# EAGLE design Peltier_Controller (EAGLE 8.1.0)

## Sheet 1 of 2
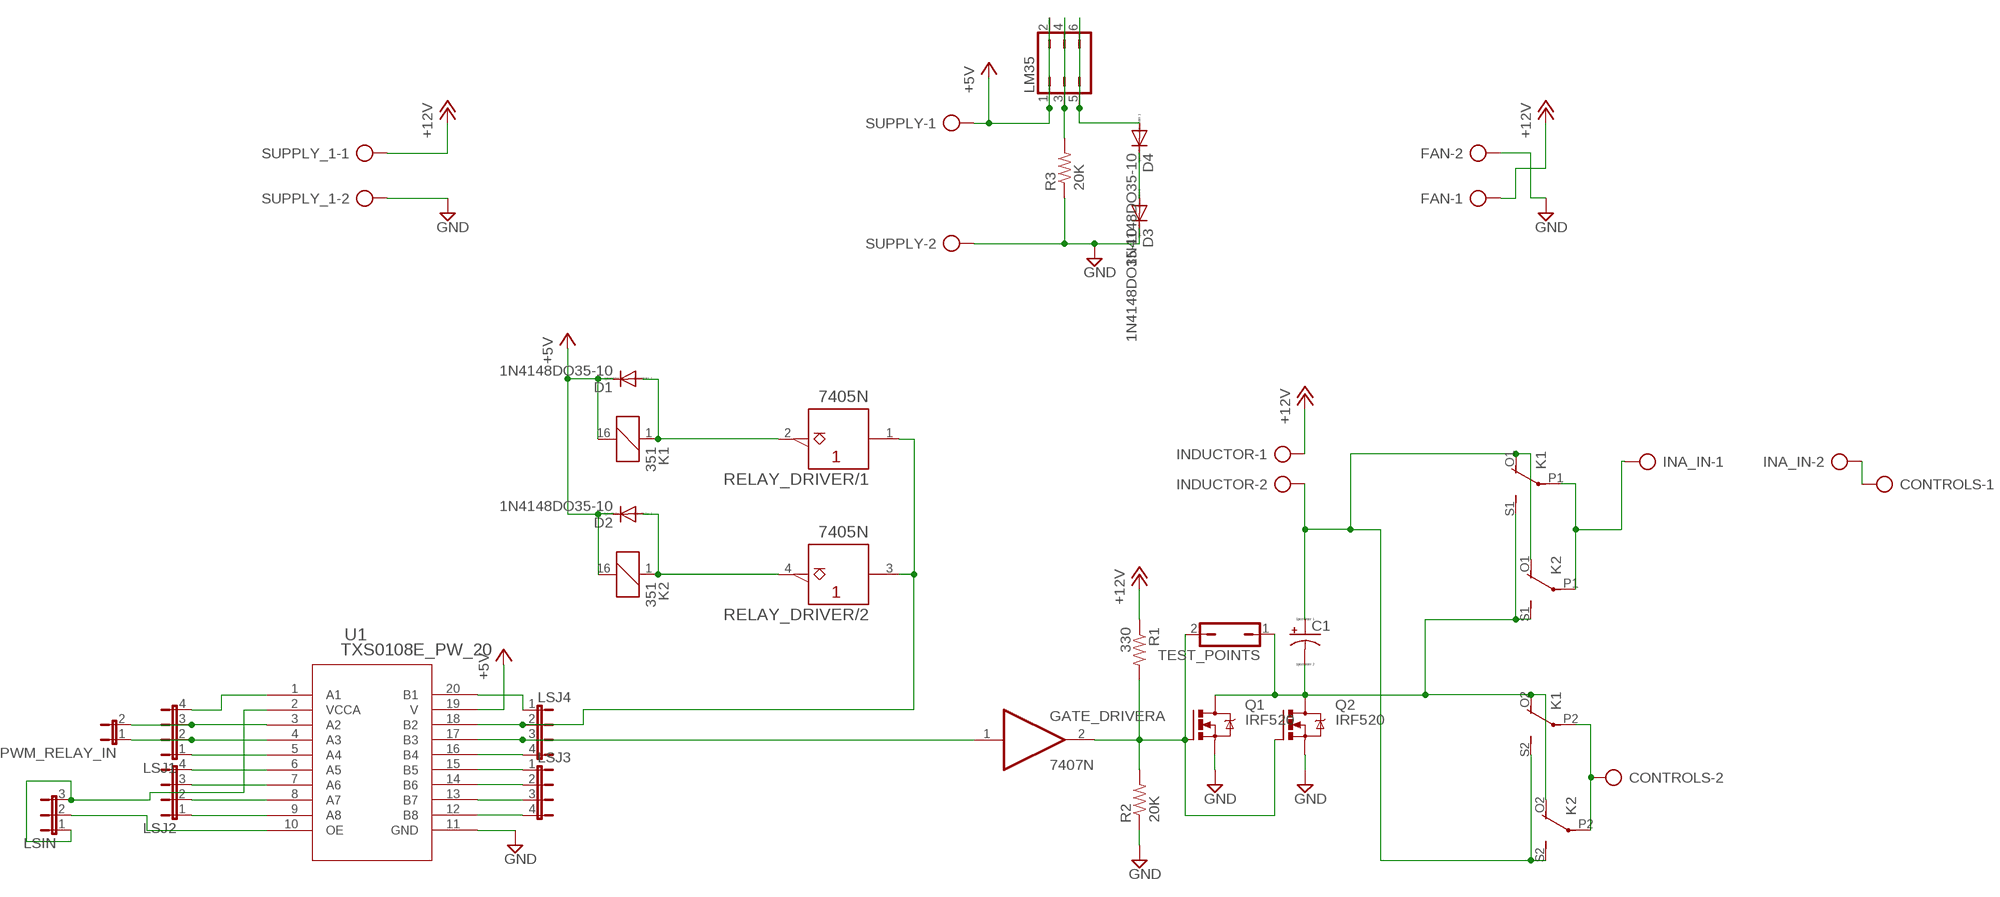
[diagram p0: schematic, sheet 1]

### Parts
C1  CPOL-USTT6D6  [TT5D6]
CONTROLS  AK500/2-H  [AK500/2-H]
D1  1N4148DO35-10  [DO35-10]
D2  1N4148DO35-10  [DO35-10]
D3  1N4148DO35-10  [DO35-10]
D4  1N4148DO35-10  [DO35-10]
FAN  AK500/2-H  [AK500/2-H]
GATE_DRIVER  7407N  [DIL14]
INA_IN  AK500/2-H  [AK500/2-H]
INDUCTOR  AK500/2-H  [AK500/2-H]
K1  351  [351]
K2  351  [351]
LM35  JP3Q  [JP3Q]
LSIN  JP2E  [JP2]
LSJ1  JP4E  [JP4]
LSJ2  JP4E  [JP4]
LSJ3  JP4E  [JP4]
LSJ4  JP4E  [JP4]
PWM_RELAY_IN  JP1E  [JP1]
Q1  IRF520  [TO220BV]
Q2  IRF520  [TO220BV]
R1  330  R-US_0207/12  [0207/12]
R2  20K  R-US_0207/12  [0207/12]
R3  20K  R-US_0207/12  [0207/12]
RELAY_DRIVER  7405N  [DIL14]
SUPPLY  AK500/2-H  [AK500/2-H]
SUPPLY_1  AK500/2-H  [AK500/2-H]
TEST_POINTS  JP1Q  [JP1]
U1  TXS0108E_PW_20  [PW20]

### Nets
+5V: D1.C D2.C K1.16 K2.16 LM35.1 LM35.2 SUPPLY.1 U1.19(V) ; also sheet 2
+12V: FAN.1 INDUCTOR.1 R1.1 SUPPLY_1.1
GND: D3.C FAN.2 Q1.S Q2.S R2.1 R3.1 SUPPLY.2 SUPPLY_1.2 U1.11(GND) ; also sheet 2
IN+: CONTROLS.1 INA_IN.2 ; also sheet 2
IN-: INA_IN.1 K1.P1(2:P) K2.P1(2:P) ; also sheet 2
N$1: LSJ1.3 PWM_RELAY_IN.2 U1.3(A2)
N$2: D2.A K2.1 RELAY_DRIVER.4(/2:Y)
N$3: LM35.3 LM35.4 R3.2
N$4: D1.A K1.1 RELAY_DRIVER.2(/1:Y)
N$5: GATE_DRIVER.2(A:O) Q1.G Q2.G R1.2 R2.2 TEST_POINTS.2
N$6: D4.A LM35.5 LM35.6
N$7: D3.A D4.C
N$8: LSJ1.4 U1.1(A1)
N$9: LSJ4.1 U1.20(B1)
N$12: CONTROLS.2 K1.P2(3:P) K2.P2(3:P)
N$13: C1.- K1.O2(3:O) K1.S1(2:S) K2.O2(3:O) K2.S1(2:S) Q1.D Q2.D TEST_POINTS.1
N$15: LSJ1.2 PWM_RELAY_IN.1 U1.4(A3)
N$16: LSJ1.1 U1.5(A4)
N$17: LSJ2.4 U1.6(A5)
N$18: LSJ2.3 U1.7(A6)
N$19: LSJ2.2 U1.8(A7)
N$20: LSJ2.1 U1.9(A8)
N$21: LSIN.2 U1.10(OE)
N$22: LSIN.1 LSIN.3 U1.2(VCCA)
N$23: LSJ4.2 RELAY_DRIVER.1(/1:A) RELAY_DRIVER.3(/2:A) U1.18(B2)
N$25: GATE_DRIVER.1(A:I) LSJ4.3 U1.17(B3)
N$26: LSJ4.4 U1.16(B4)
N$27: LSJ3.1 U1.15(B5)
N$28: LSJ3.2 U1.14(B6)
N$29: LSJ3.3 U1.13(B7)
N$30: LSJ3.4 U1.12(B8)
VBUS: C1.+ INDUCTOR.2 K1.O1(2:O) K1.S2(3:S) K2.O1(2:O) K2.S2(3:S) ; also sheet 2
Unconnected: GATE_DRIVER.3(B:I) GATE_DRIVER.4(B:O) GATE_DRIVER.5(C:I) GATE_DRIVER.6(C:O) GATE_DRIVER.8(D:O) GATE_DRIVER.9(D:I) GATE_DRIVER.10(E:O) GATE_DRIVER.11(E:I) GATE_DRIVER.12(F:O) GATE_DRIVER.13(F:I) RELAY_DRIVER.5(/3:A) RELAY_DRIVER.6(/3:Y) RELAY_DRIVER.8(/4:Y) RELAY_DRIVER.9(/4:A) RELAY_DRIVER.10(/5:Y) RELAY_DRIVER.11(/5:A) RELAY_DRIVER.12(/6:Y) RELAY_DRIVER.13(/6:A)

## Sheet 2 of 2
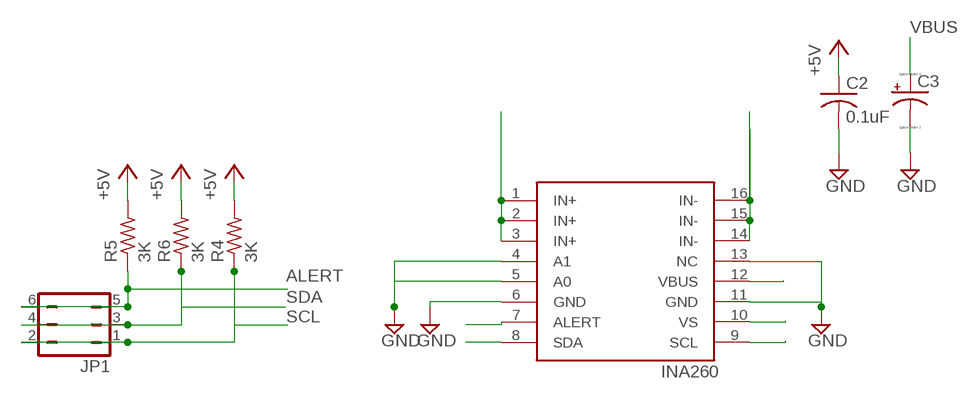
[diagram p1: schematic, sheet 2]

### Parts
C2  0.1uF  C-US050-025X075  [C050-025X075]
C3  CPOL-USE5-10.5  [E5-10,5]
JP1  JP3Q  [JP3Q]
R4  3K  R-US_0207/10  [0207/10]
R5  3K  R-US_0207/10  [0207/10]
R6  3K  R-US_0207/10  [0207/10]
U$1  INA260  [TSSOP16]

### Nets
+5V: C2.1 R4.2 R5.2 R6.2 U$1.10(VS) ; also sheet 1
ALERT: JP1.5 JP1.6 R5.1 U$1.7(ALERT)
GND: C2.2 C3.- U$1.4(A1) U$1.5(A0) U$1.6(GND) U$1.11(GND) U$1.13(NC) ; also sheet 1
IN+: U$1.1(IN+) U$1.2(IN+) U$1.3(IN+) ; also sheet 1
IN-: U$1.14(IN-) U$1.15(IN-) U$1.16(IN-) ; also sheet 1
SCL: JP1.1 JP1.2 R4.1 U$1.9(SCL)
SDA: JP1.3 JP1.4 R6.1 U$1.8(SDA)
VBUS: C3.+ U$1.12(VBUS) ; also sheet 1

## Power pins joined to a net without a drawn wire
+5V: GATE_DRIVER.14(P:VCC) RELAY_DRIVER.14(+5V:+UB)
GND: GATE_DRIVER.7(P:GND) RELAY_DRIVER.7(GND:-UB)

## Library data of the parts
C1 C3 = resistor:CPOL-US: POLARIZED CAPACITOR, American symbol
C2 = resistor:C-US: CAPACITOR, American symbol
CONTROLS FAN INA_IN INDUCTOR SUPPLY SUPPLY_1 = con-ptr500:AK500/2-H: CONNECTOR Aug. 2004 / PTR Meßtechnik: Die Bezeichnung der Serie AK505 wurde geändert. Es handelt sich hierbei um AK500 in horizontaler Ausführung.; OC_FARNELL: unknown; OC_NEWARK: unknown
D1-D4 = diode:1N4148: DIODE high speed (Philips)
GATE_DRIVER = 74xx-eu:74*07: Hex BUFFER, open collector high-voltage output
JP1 LM35 = jumper:JP3Q: JUMPER
K1 K2 = relay:351: RELAY 2 x switch, Omron; OC_FARNELL: unknown; OC_NEWARK: unknown
LSIN = jumper:JP2E: JUMPER
LSJ1-LSJ4 = jumper:JP4E: JUMPER
PWM_RELAY_IN = jumper:JP1E: JUMPER
Q1 Q2 = transistor-power:IRF520: HEXFET Power MOSFET
R1-R3 = resistor:R-US_: RESISTOR, American symbol
R4-R6 = rcl:R-US_: RESISTOR, American symbol
RELAY_DRIVER = 74ttl-din:74*05: Hex INVERTER, open collector
TEST_POINTS = jumper:JP1Q: JUMPER
U1 = texas:TXS0108E_PW_20; DATASHEETURL: httpwww.ti.comlitgpnTXS0108E; FAMILY_NAME: AUTO DIRECTION SENSING DUAL SUPPLY TRANSLATOR; GENERIC_PART_NUMBER: TXS0108E; INDUSTRY_STD_PKG_TYPE: TSSOP; MANUFACTURER: Texas Instruments; MANUFACTURER_PART_NUMBER: txs0108e_pw_20; PACKAGE_DESIGNATOR: PW; PIN_COUNT: 20; VENDOR: Texas Instruments
U$1 = INA260:INA260: High/Low-Side Digital Current/Power Monitor with Integrated 2mΩ Shunt Resistor http://www.ti.com/product/INA260/description; MANUFACTURER: Texas Instruments

## Net classes
0 default: width 0.406 mm, drill 0.762 mm, clearance 0.406 mm

## Board
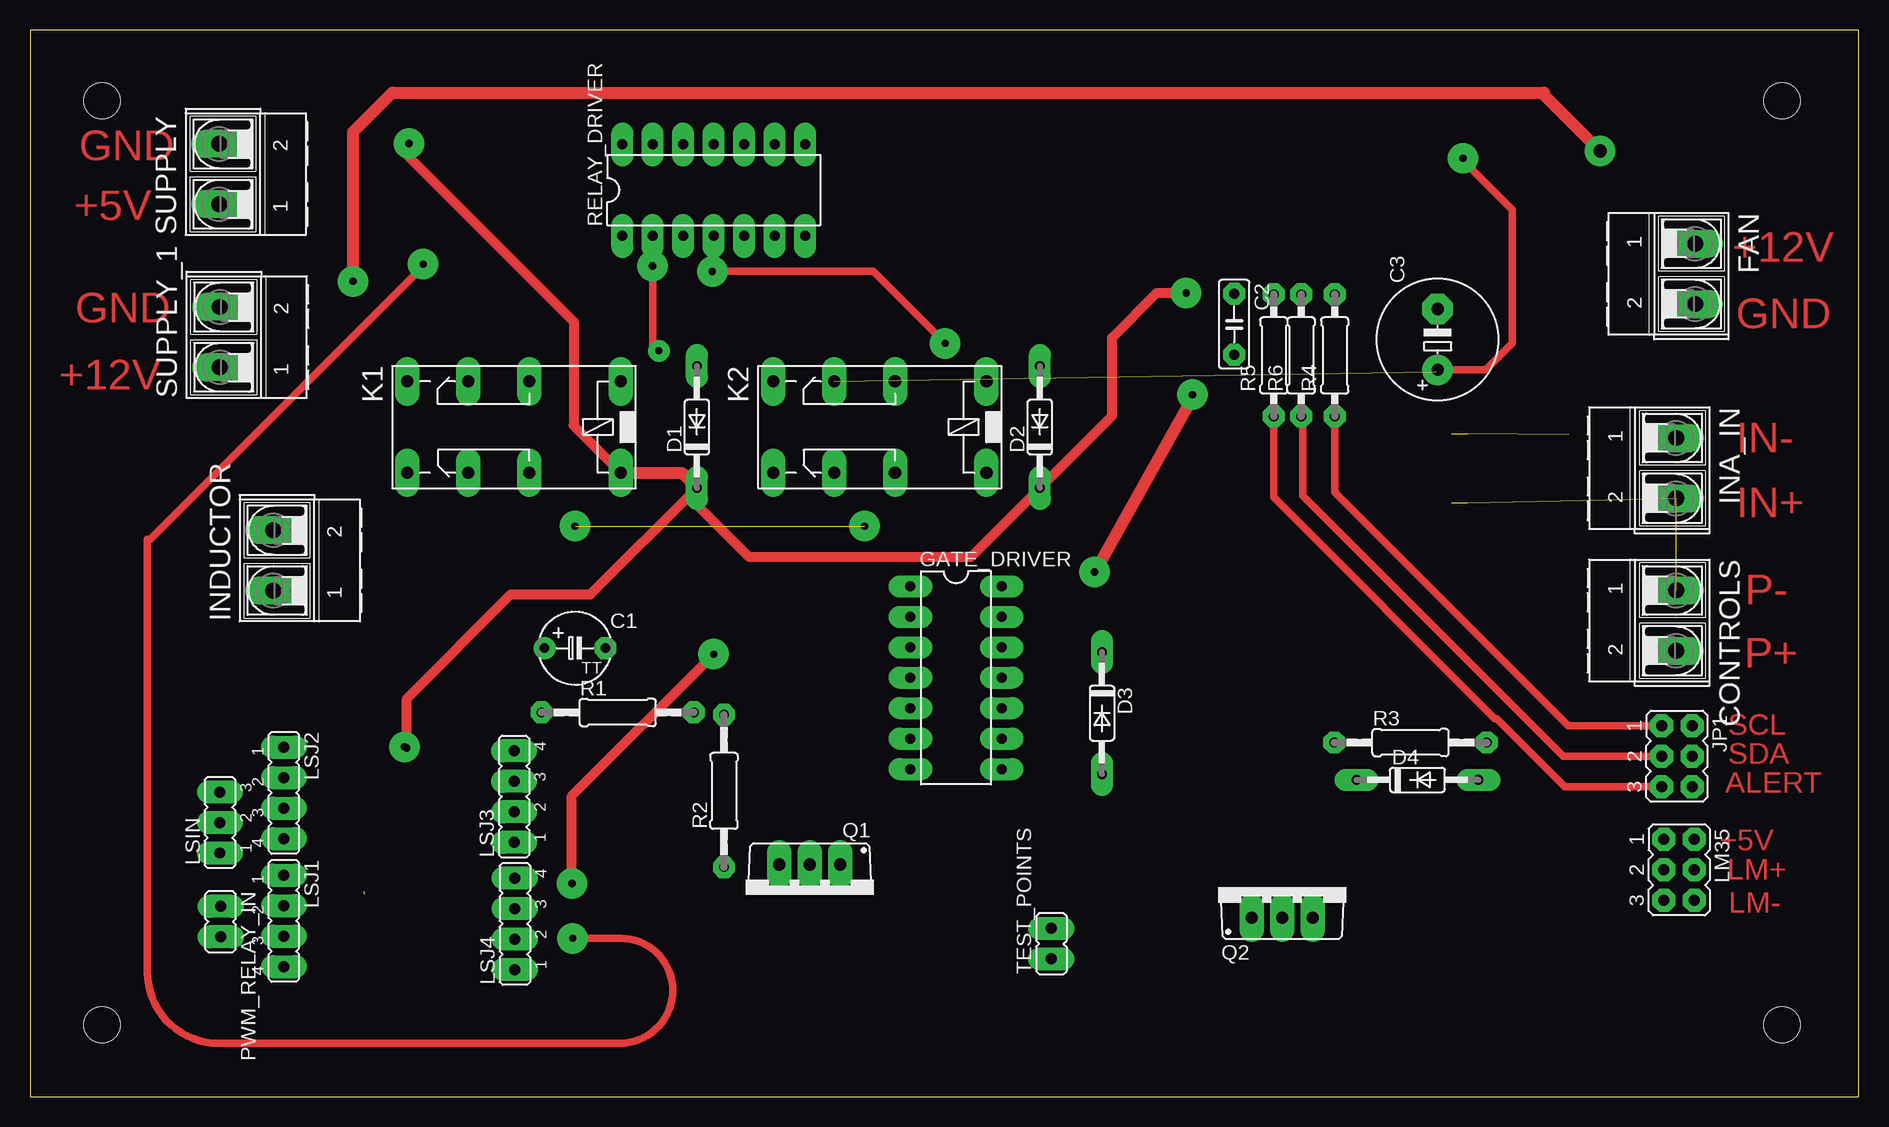
[diagram p2: board, top side]
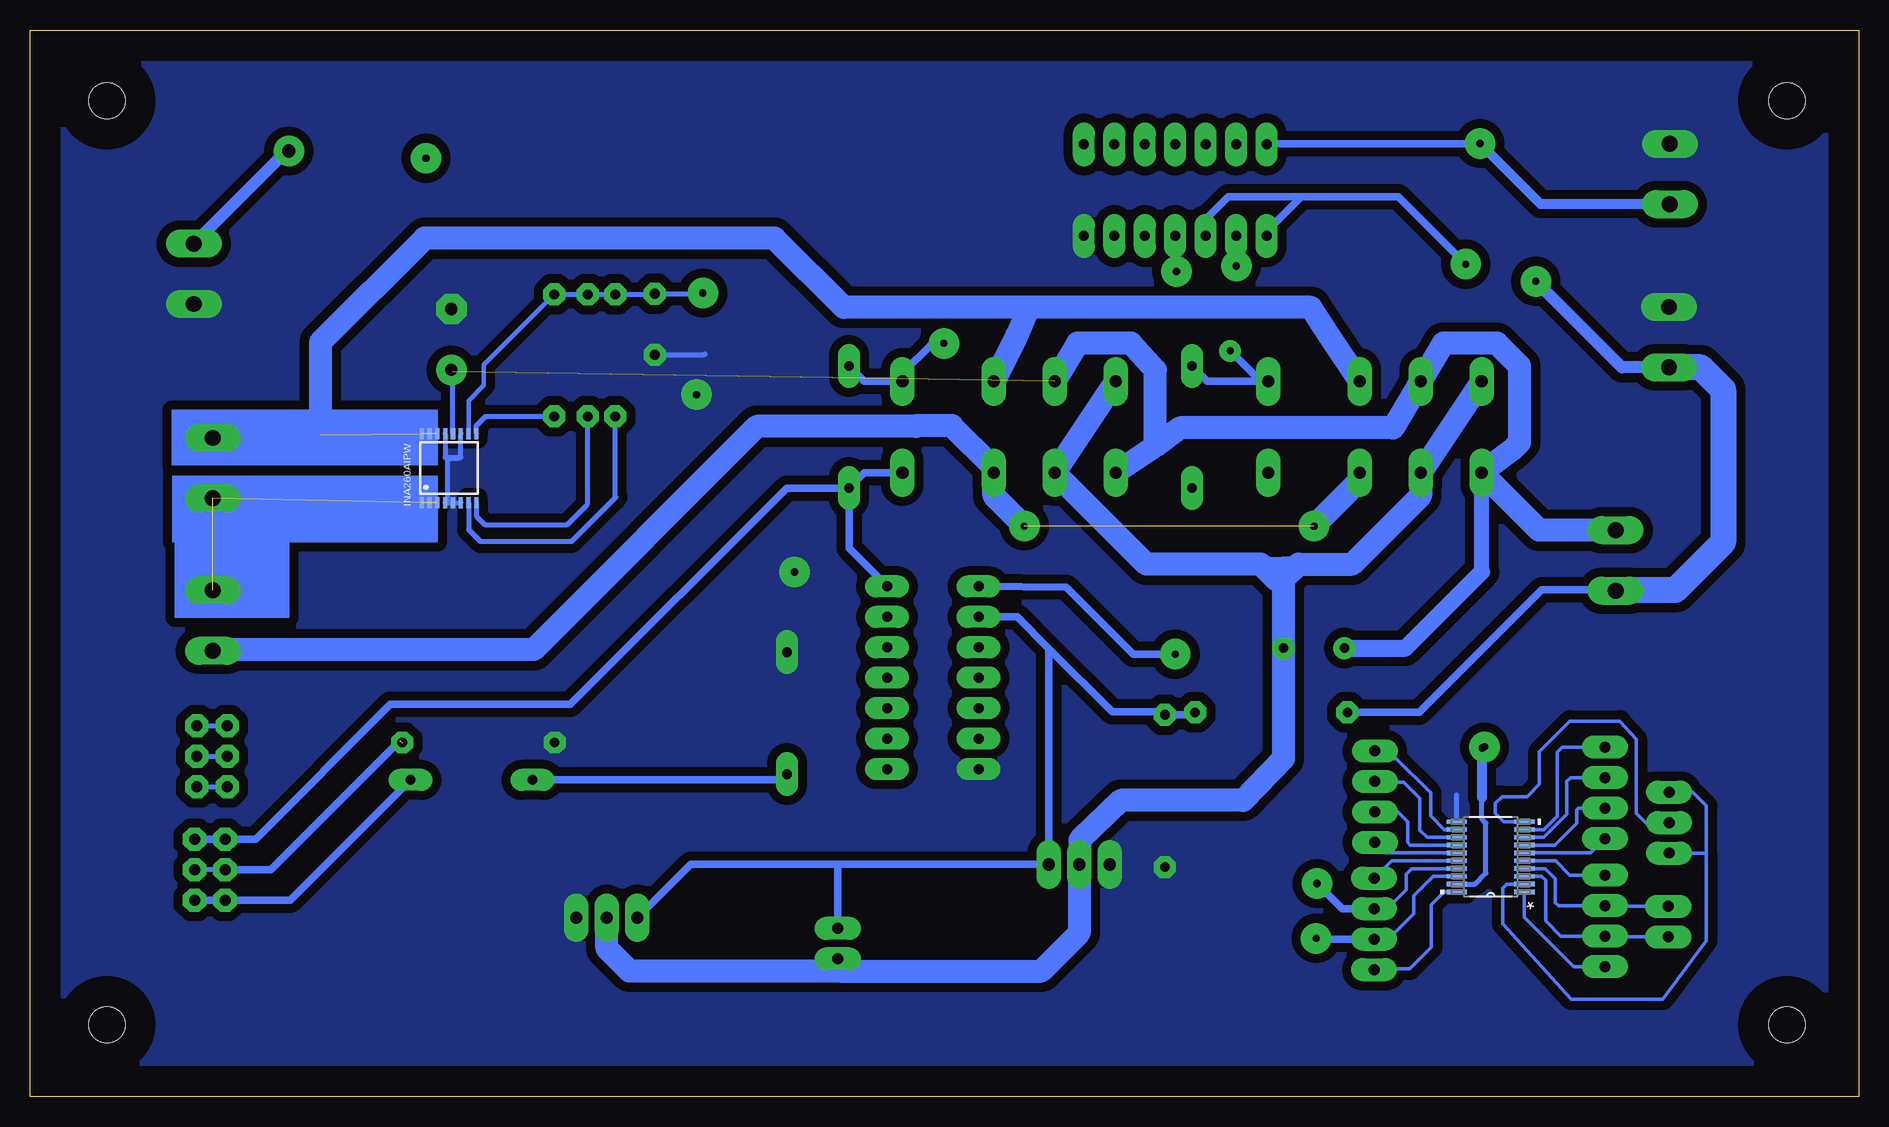
[diagram p3: board, bottom side, seen from below]

Size 152.41 x 88.89 mm. Coordinates in mm from the lower left corner, seen from the top.
Outline: 0,0 152.41,0 152.41,88.89 0,88.89 0,0
Copper layers (1*16): Top 0.035mm / dielectric 1.5mm / Bottom 0.035mm
Design rules "default *": minimum track width 10mil, minimum drill 24mil, track to track 30mil, track to pad 30mil, pad to pad 30mil, via to via 40mil, smd to smd 8mil, copper to edge 100mil, drill to drill 20mil, minimum pad ring 20mil, minimum via ring 8mil, stop-mask expansion 4mil, vias tented up to drill 0mil, thermal gap 0mil
Holes 3 mm at 6,6 6,83 146,6 146,83

### Footprints (pad centres in the part's own frame; a part is rotated, then mirrored left to right if it is on the bottom)
TT5D6 = drill 0.813: + -2.54,0 | drill 0.813 octagon: - 2.54,0
C050-025X075 = drill 0.813 octagon: 1 -2.54,0; 2 2.54,0
E5-10,5 = drill 1.016 pad 2.54: + -2.54,0 | drill 1.016 pad 2.54 octagon: - 2.54,0
AK500/2-H = drill 1.321 long: 1 -2.515,0; 2 2.515,0
DO35-10 = drill 0.813 long: A 5.08,0; C -5.08,0
DIL14 = drill 0.813 long: 1 -7.62,-3.81; 2 -5.08,-3.81; 3 -2.54,-3.81; 4 0,-3.81; 5 2.54,-3.81; 6 5.08,-3.81; 7 7.62,-3.81; 8 7.62,3.81; 9 5.08,3.81; 10 2.54,3.81; 11 0,3.81; 12 -2.54,3.81; 13 -5.08,3.81; 14 -7.62,3.81
JP3Q = drill 0.914 octagon: 1 -2.54,-1.27; 2 -2.54,1.27; 3 0,-1.27; 4 0,1.27; 5 2.54,-1.27; 6 2.54,1.27
351 = drill 1.016 long: 1 -3.81,-3.81; 16 -3.81,3.81; O1 8.89,-3.81; O2 8.89,3.81; P1 3.81,-3.81; P2 3.81,3.81; S1 13.97,-3.81; S2 13.97,3.81
JP2 = drill 0.914 long: 1 -2.54,0; 2 0,0; 3 2.54,0
JP4 = drill 0.914 long: 1 -3.81,0; 2 -1.27,0; 3 1.27,0; 4 3.81,0
JP1 = drill 0.914 long: 1 0,-1.27; 2 0,1.27
TO220BV = drill 1.016 long: D 0,-2.54; G -2.54,-2.54; S 2.54,-2.54
0207/12 = drill 0.813 octagon: 1 -6.35,0; 2 6.35,0
0207/10 = drill 0.813 octagon: 1 -5.08,0; 2 5.08,0
PW20 = smd 1.676 x 0.356: 1 -2.819,2.925; 2 -2.819,2.275; 3 -2.819,1.625; 4 -2.819,0.975; 5 -2.819,0.325; 6 -2.819,-0.325; 7 -2.819,-0.975; 8 -2.819,-1.625; 9 -2.819,-2.275; 10 -2.819,-2.925; 11 2.819,-2.925; 12 2.819,-2.275; 13 2.819,-1.625; 14 2.819,-0.975; 15 2.819,-0.325; 16 2.819,0.325; 17 2.819,0.975; 18 2.819,1.625; 19 2.819,2.275; 20 2.819,2.925
TSSOP16 = smd 0.9 x 0.35: 1 -2.875,2.275; 2 -2.875,1.625; 3 -2.875,0.975; 4 -2.875,0.325; 5 -2.875,-0.325; 6 -2.875,-0.975; 7 -2.875,-1.625; 8 -2.875,-2.275; 9 2.875,-2.275; 10 2.875,-1.625; 11 2.875,-0.975; 12 2.875,-0.325; 13 2.875,0.325; 14 2.875,0.975; 15 2.875,1.625; 16 2.875,2.275

### Placement (x,y rotation side)
C1  45.42,37.38 0 top
C2  100.35,64.37 270 top
C3  117.3,63.1 90 top
CONTROLS  137.18,39.67 270 top
D1  55.58,55.8 90 top
D2  84.15,55.8 90 top
D3  89.33,31.96 270 top
D4  115.62,26.4 0 top
FAN  138.76,68.56 270 top
GATE_DRIVER  77.17,34.91 270 top
INA_IN  137.18,52.37 270 top
INDUCTOR  20.27,44.69 90 top
JP1  137.24,28.37 270 top
K1  45.42,55.8 180 top
K2  75.9,55.8 180 top
LM35  137.43,18.91 270 top
LSIN  15.83,22.84 90 top
LSJ1  21.16,14.65 270 top
LSJ2  21.16,25.32 270 top
LSJ3  40.34,25 90 top
LSJ4  40.4,14.4 90 top
PWM_RELAY_IN  15.89,14.59 180 top
Q1  64.98,16.81 180 top
Q2  104.35,17.45 0 top
R1  48.97,32.02 0 top
R2  57.83,25.48 90 top
R3  115.05,29.51 0 top
R4  108.73,61.77 90 top
R5  103.65,61.77 90 top
R6  105.93,61.77 90 top
RELAY_DRIVER  56.98,75.55 0 top
SUPPLY  15.76,76.88 90 top
SUPPLY_1  15.83,63.29 90 top
TEST_POINTS  85.11,12.75 0 top
U1  30.69,19.99 180 bottom
U$1  117.49,52.37 90 bottom

### Tracks (layer width: path | path; a pad name or v marks a point on that pad's centre or on a via)
+5V  (via drill 0.6, 0.6 pad 2.54)
  Top 0.813: v96.34,66.98 93.9,66.98 90.17,63.25 90.17,56.74 D2.C 78.39,44.96 59.94,44.96 55.58,49.32 D1.C 46.7,41.85 40.07,41.85 31.4,33.18 v31.4,29.05 | v31.57,79.42 31.57,78.31 45.31,64.58 45.31,55.91 K1.16
  Top 1.016: K1.16 54.31,51.99 D1.C
  Bottom 0.356: U$1.10 115.86,58 114.59,59.28 114.59,60.99 R4.2
  Bottom 0.406: R4.2 R6.2 R5.2 100.41,66.85 C2.1 96.28,66.91 | 96.15,66.91 96.28,66.91 | 96.28,66.91 v96.34,66.98 | U1.19 31.98,17.71 31.08,18.61 31.08,22.8 31.42,23.14 31.42,24.89 31.4,24.92
  Bottom 0.61: v31.57,79.42 49.29,79.42 RELAY_DRIVER.14 | K2.16 82.88,51.99 D2.C | D2.C 89.36,50.72 107.39,32.69 122.38,32.69 133.62,21.45 LM35.1 LM35.2 | GATE_DRIVER.14 84.15,45.7 D2.C
  Bottom 0.813: 31.4,24.92 v31.4,29.05 | SUPPLY.1 26.52,74.37 v31.57,79.42
+12V  (via drill 0.6 pad 2.54, 1.1 pad 2.54)
  Top 1.016: v26.92,67.94 26.92,80.39 30.19,83.66 126.18,83.66 126.18,83.47 v130.84,78.8
  Bottom 0.61: R1.1 36.66,32.02 26.45,42.23 20.33,42.23 INDUCTOR.1
  Bottom 1.016: SUPPLY_1.1 19.76,60.78 v26.92,67.94 27.02,68.04 | v130.84,78.8 131.04,78.8 FAN.1
  Bottom 2.184: SUPPLY_1.1 13.19,60.78 11.32,58.91 11.32,46.21 15.32,42.21 20.23,42.21 INDUCTOR.1
ALERT
  Top 0.61: R5.1 103.63,56.67 103.63,49.94 122.08,31.49 122.22,31.49 127.88,25.83 JP1.5
  Bottom 0.406: JP1.6 JP1.5 | U$1.7 115.86,47.25 114.89,46.27 107.27,46.27 103.68,49.86 | 103.68,49.86 103.58,49.96 | 103.58,56.63 R5.1 103.65,49.86 103.68,49.86
GND  (via drill 0.6 pad 2.54)
  Top 1.016: v96.87,58.5 96.98,58.45 v88.71,43.72
  Bottom 0.406: U$1.13 117.81,55.25 117.81,53.26 116.73,53.26 | 116.73,53.26 116.52,53.26 U$1.11 | U$1.5 U$1.6 | U$1.5 117.58,49.5 117.58,53.03 117.73,53.18 116.81,53.18 116.73,53.26 | U$1.4 U$1.5 | C2.2 96.22,61.83 96.15,61.9 | U1.11 33.53,22.91 33.53,25.15
  pour Bottom: 0.35,88.55 152.08,88.55 152.05,0.35 0.35,0.35
IN+  (4 unrouted)
IN-  (3 unrouted)
  Bottom 1.27: K2.P1 72.09,58.34
  Bottom 1.93: K1.P1 44.15,63.42 45.67,65.77 69.17,65.77 | K2.P1 70.18,63.42 69.17,65.77 | INA_IN.1 128.5,54.89 128.22,55.16 128.22,62.85 119.52,71.55 90.38,71.55 84.6,65.77 69.17,65.77
N$1
  Bottom 0.305: PWM_RELAY_IN.2 21.1,13.32 LSJ1.3 24.84,13.38 26.11,14.65 26.11,18.02 26.46,18.36 U1.3
N$2  (via drill 0.6 pad 2.54)
  Top 0.61: v56.86,68.77 70.27,68.77 v76.26,62.77
  Bottom 0.61: D2.A 82.88,59.61 K2.1 79.71,60.28 77.28,62.71 76.33,62.71 v76.26,62.77 | RELAY_DRIVER.4 56.98,68.91 57.05,68.83 56.93,68.83 v56.86,68.77
N$3  (1 unrouted)
  Bottom 0.406: LM35.3 LM35.4
  Bottom 0.61: 121.62,29.64 132.35,18.91 LM35.3
N$4  (via drill 0.6 pad 0.81, 0.6 pad 1.78)
  Top 0.61: v51.9,69.2 51.9,62.66 v52.4,62.15
  Bottom 0.305: K1.1 49.86,59.61
  Bottom 0.61: D1.A 54.31,59.61 K1.1 | 49.86,59.61 v52.4,62.15 | RELAY_DRIVER.2 v51.9,69.2
N$5
  Bottom 0.406: 97.36,19.35 85.04,19.35 Q1.G
  Bottom 0.61: TEST_POINTS.2 85.11,19.29 85.04,19.35 | Q2.G 97.36,19.35 Q1.G 67.52,37.32 67.5,37.34 | GATE_DRIVER.2 70.15,39.99 67.5,37.34 | 67.5,37.34 62.23,32.07 58.07,32.07 R2.2 55.51,31.83 R1.2
N$6
  Bottom 0.61: LM35.6 LM35.5 130.73,16.37 D4.A
N$7
  Bottom 0.61: D4.C 89.81,26.4 D3.A
N$8  (1 unrouted)
  Bottom 0.305: LSJ1.4 23.77,10.84 27.89,14.97 27.89,16.87
N$9
  Bottom 0.305: U1.20 34.56,17.06 35.64,15.99 35.64,12.43 37.42,10.65 40.34,10.65 LSJ4.1
N$11  (via drill 0.6 pad 2.54)
  other vias: 31.21,29.15
N$12  (via drill 0.6 pad 2.54)  (1 unrouted)
  Bottom 1.422: K1.P2 41.61,51.35
  Bottom 1.93: 41.61,51.35 v45.42,47.55 | v69.55,47.55 72.09,50.09 K2.P2 72.09,52.43 75.58,55.93 78.5,55.93 78.57,55.85 91.85,55.85 110.44,37.26 137.07,37.26 CONTROLS.2
N$13
  Bottom 0.406: 65.61,14.27 64.98,13.64
  Bottom 0.61: TEST_POINTS.1 85.11,10.65 84.92,10.46
  Bottom 0.813: 47.96,43.1 48.59,43.1 | 47.96,43.1 47.96,44.37 | 47.96,43.1 49.23,44.37
  Bottom 1.27: 49.86,44.37 49.23,44.37 47.96,44.37 46.69,44.37
  Bottom 1.93: K1.S1 K1.O2 36.53,50.09 42.24,44.37 46.69,44.37 47.96,43.1 C1.- 47.96,28.18 51.32,24.68 61.51,24.68 64.92,21.4 64.92,19.4 Q1.D 64.98,13.64 68.15,10.46 84.92,10.46 102.44,10.46 104.35,12.37 Q2.D | K2.S1 K2.O2 59.39,44.37 49.86,44.37 48.59,43.1
N$14  (via drill 0.6 pad 2.54)
  other vias: 51.88,69.22
N$15
  Bottom 0.305: PWM_RELAY_IN.1 21.1,15.86 LSJ1.2 25.04,15.92 25.29,16.18 25.29,18.14 26.16,19.01 U1.4
N$16
  Bottom 0.305: U1.5 25.28,19.66 24.08,18.46 LSJ1.1
N$17
  Bottom 0.305: U1.6 22.36,20.31 LSJ2.4
N$18
  Bottom 0.305: U1.7 25.33,20.96 23.51,22.78 23.51,23.92 23.38,24.05 LSJ2.3
N$19
  Bottom 0.305: U1.8 26.27,21.61 24.34,23.54 24.34,26.27 24.02,26.59 LSJ2.2
N$20
  Bottom 0.305: U1.9 26.25,22.26 25.16,23.35 25.16,28.69 24.72,29.13 LSJ2.1
N$21
  Bottom 0.305: U1.10 29.61,22.91 30.3,23.61 30.3,24.43 29.73,25 27.64,25 26.62,26.02 26.62,28.75 24.08,31.29 19.93,31.29 18.57,29.8 18.57,23.62 17.73,22.78 LSIN.2
N$22
  Bottom 0.305: 12.72,20.11 12.72,24.24 13.86,25.38 LSIN.3 | 12.72,20.11 12.72,13 16.34,8.13 23.95,8.13 29.67,14.4 29.67,17.38 29.34,17.71 U1.2 | LSIN.1 12.91,20.3 12.72,20.11
N$23  (via drill 0.6 pad 2.54)
  Top 0.61: v45.23,13.19 49.23,13.19 arc-90 53.56,8.86 arc-90 49.15,4.45 15.72,4.45 arc-90 9.78,10.38 9.78,46.45 10,46.45 32.64,69.09 32.64,69.25 v32.77,69.37
  Bottom 0.305: U1.18 35.49,18.36 37.1,16.75 37.1,15.22 39.13,13.19 40.34,13.19 LSJ4.2
  Bottom 0.61: LSJ4.2 45.16,13.13 45.23,13.06 v45.23,13.19 | v32.77,69.37 38.39,74.99 46.48,74.99 | 46.48,74.99 49.35,72.12 RELAY_DRIVER.1 | 46.48,74.99 52.55,74.99 54.44,73.11 RELAY_DRIVER.3
N$25  (via drill 0.6 pad 2.54)
  Top 0.813: v45.16,17.76 45.16,25.07 v56.98,36.88
  Bottom 0.305: U1.17 37.25,19.01 37.73,18.53 37.73,17.26 38.94,16.05 40.02,16.05 LSJ4.3
  Bottom 0.61: GATE_DRIVER.1 66.06,42.47 60.47,36.88 v56.98,36.88 | LSJ4.3 43.07,15.67 v45.16,17.76 45.23,17.83
N$26
  Bottom 0.305: U1.16 38.95,19.66 LSJ4.4
N$27
  Bottom 0.305: U1.15 39.46,20.31 LSJ3.1
N$28
  Bottom 0.305: U1.14 37.38,20.96 37.61,21.19 37.61,22.91 38.43,23.73 LSJ3.2
N$29
  Bottom 0.305: U1.13 35.99,21.61 36.59,22.21 36.59,24.88 37.92,26.21 40.27,26.21 LSJ3.3
N$30
  Bottom 0.305: U1.12 34.55,22.26 35.7,23.41 35.7,25.32 38.56,28.18 39.7,28.18 LSJ3.4
SCL
  Top 0.61: R4.1 108.74,56.67 108.74,50.35 128.19,30.91 JP1.1
  Bottom 0.406: JP1.2 JP1.1 | U$1.9 115.22,55.92 114.44,56.69 R4.1 108.66,56.63
SDA
  Top 0.61: R6.1 106.08,56.55 106.08,50.07 127.78,28.37 JP1.3
  Bottom 0.406: JP1.4 JP1.3 | U$1.8 115.22,48.38 114.51,47.67 107.65,47.67 105.93,49.39 R6.1 106.12,56.5
VBUS  (via drill 0.6 pad 2.54)  (1 unrouted)
  Top 0.61: C3.+ 121.3,60.56 123.54,62.8 123.54,73.91 119.41,78.04 v119.41,78.2
  Bottom 0.406: U$1.12 117.17,60.43 C3.+
  Bottom 1.27: 31.45,43.73 31.45,50.78 31.77,51.1 31.77,51.67 K1.S2
  Bottom 1.422: C1.+ 37.8,37.38 31.45,43.73
  Bottom 1.93: 58.63,54.21 K2.S2 | 58.63,54.21 58.63,60.56 60.66,62.78 65.1,62.78 K2.O1 | 58.63,54.21 56.59,55.74 38.81,55.74 K1.O1 34.62,62.78 30.18,62.78 28.27,60.88 28.27,54.53 28.91,53.9 K1.S2 26.66,47.2 INDUCTOR.2
(copper drawn outside any net)
  shapes: Bottom area x3

### Text on the board
Top: GND | +5V | +12V | GND | GND | +12V | IN- | IN+ | P- | P+ | SCL | SDA | ALERT | +5V | LM+ | LM-